# EasyEDA Pro project 无刷电机驱动板.epro, schematic 无刷电机&舵机驱动
Board Name: Board1; Create Date: 2024-11-26; Page Name: P1; Project Name: 无刷电机驱动板; Schematic Name: 无刷电机&舵机驱动; Update Date: 2024-12-31; Company: 海思路999号412所; Drawed: YienMaster; Page Size: A3; Version: V1.0
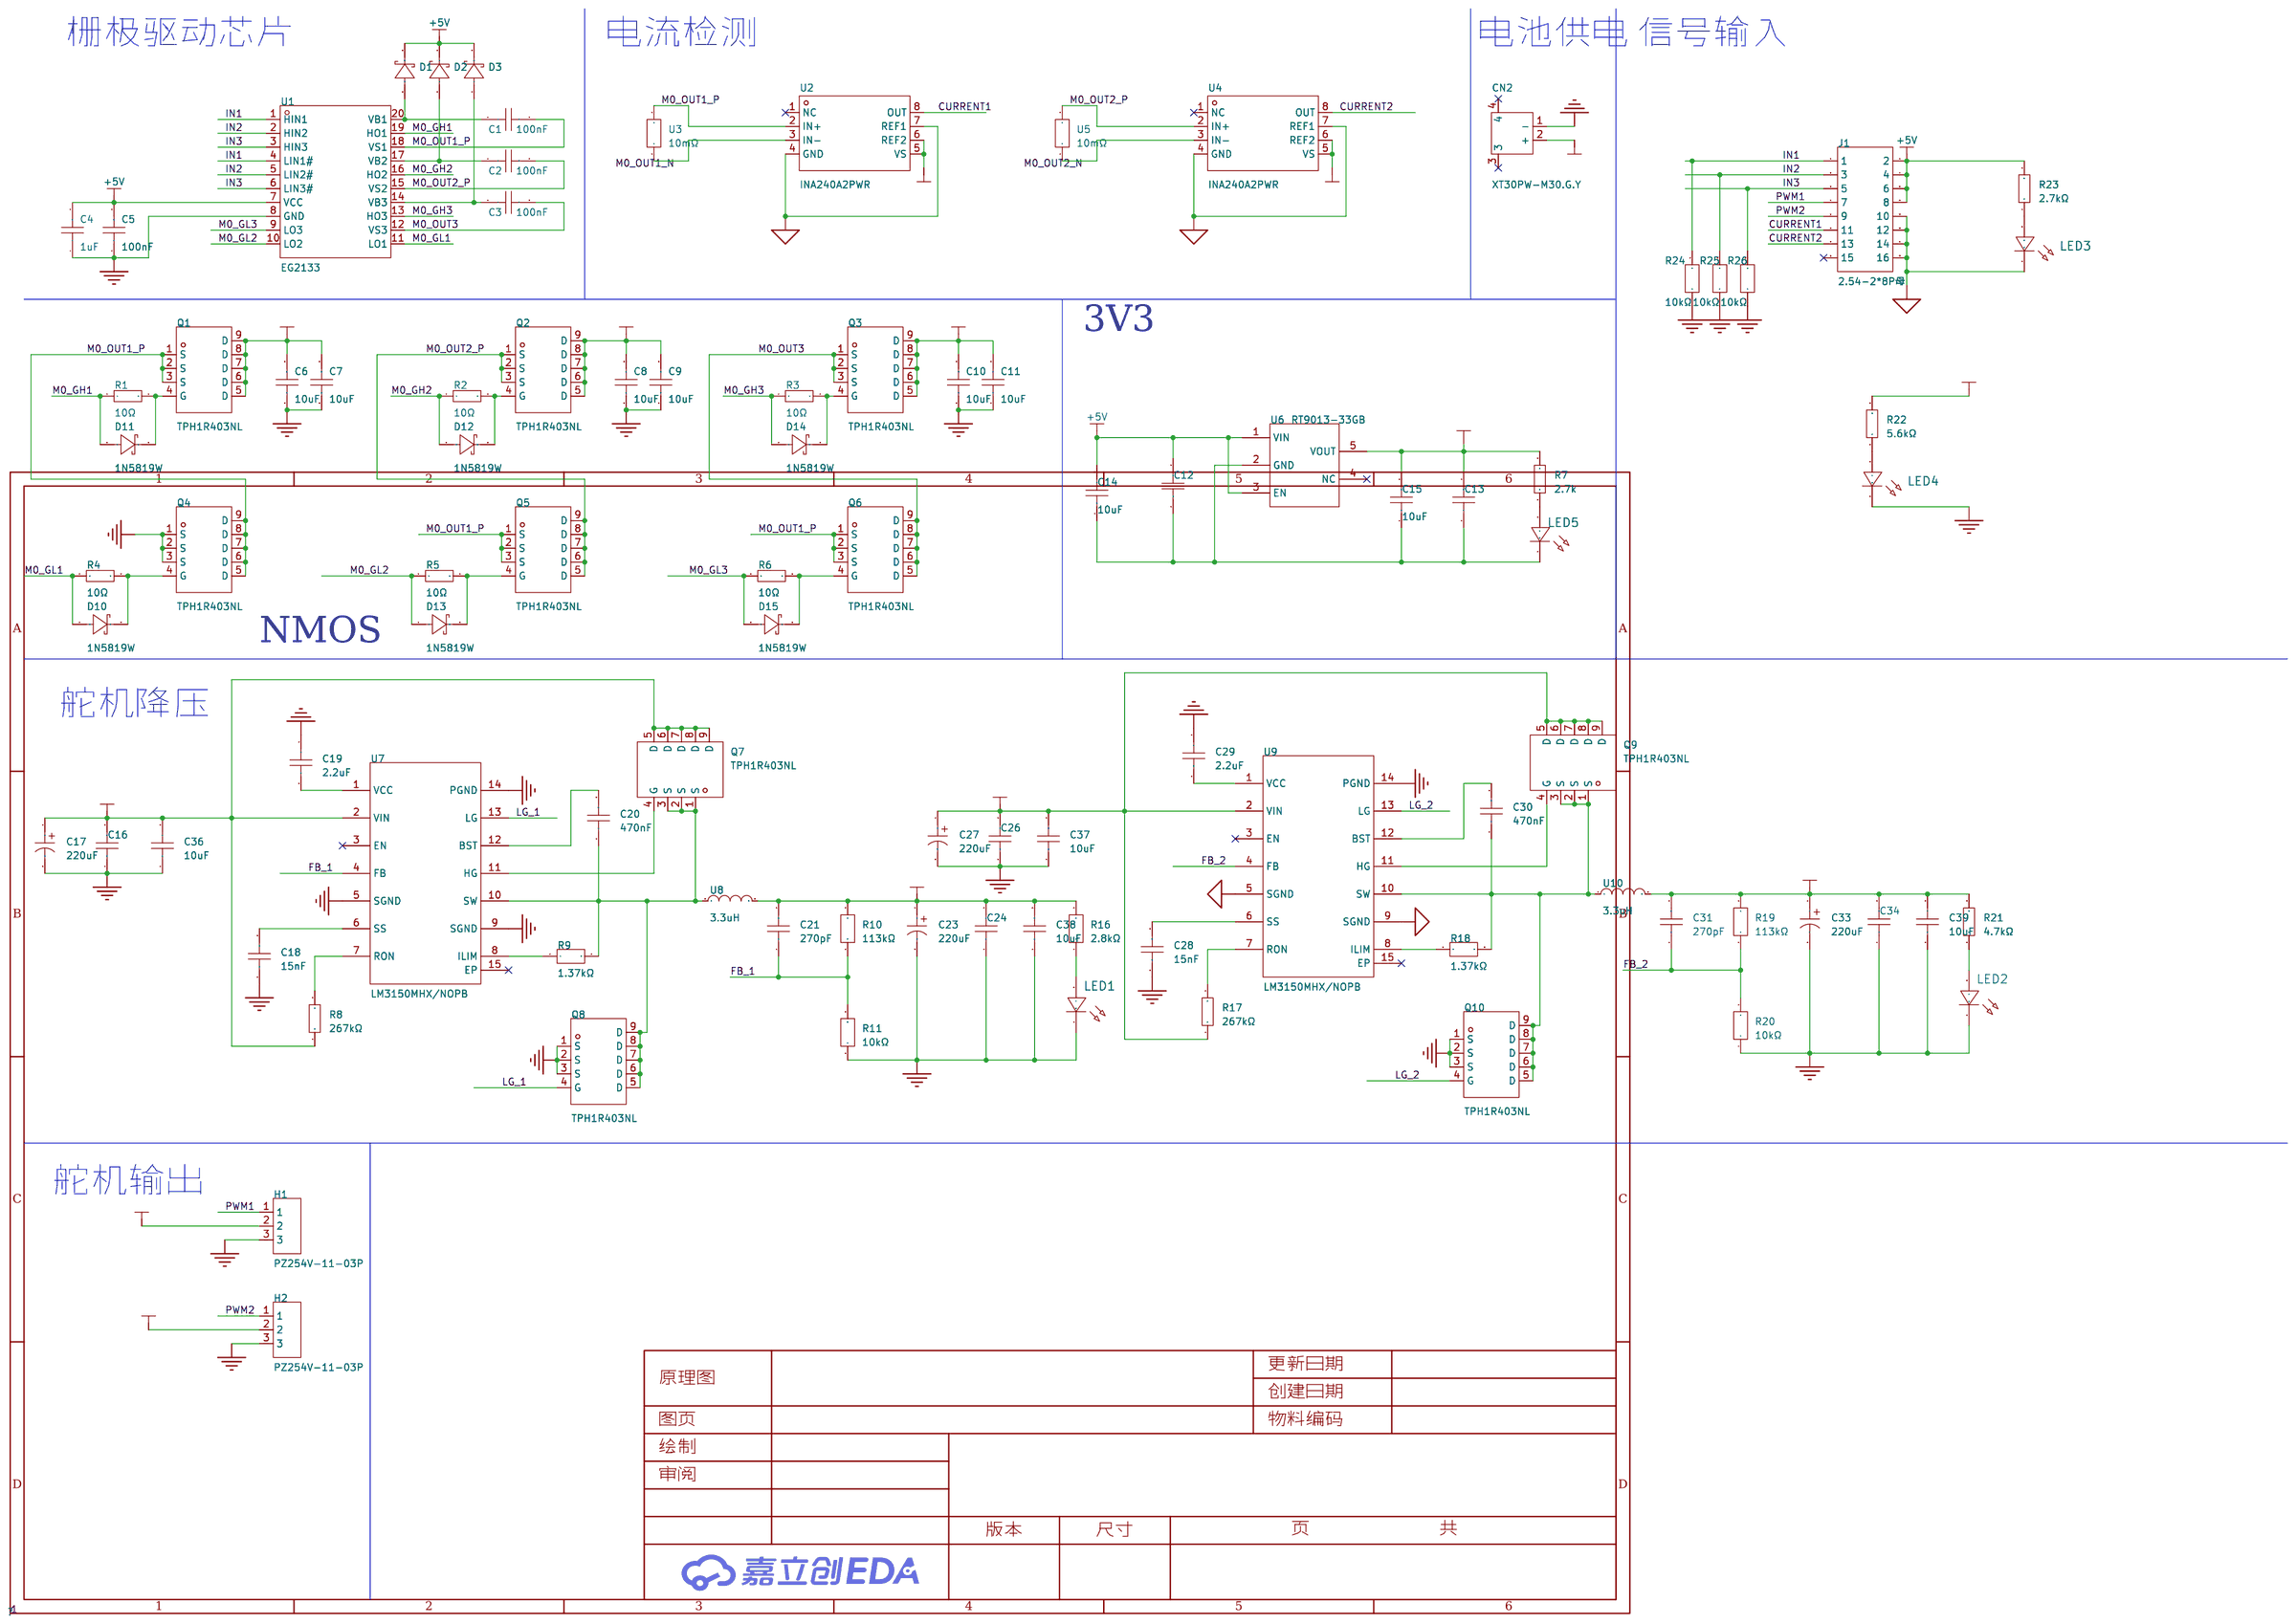
[diagram p0: schematic sheet]

## Parts
C1  100nF  [C0603]
C2  100nF  [C0603]
C3  100nF  [C0603]
C4  1uF  [C0603]
C5  100nF  [C0603]
C6  10uF  [C0603]
C7  10uF  [C0603]
C8  10uF  [C0603]
C9  10uF  [C0603]
C10  10uF  [C0603]
C11  10uF  [C0603]
C12  100nF  [C0603]
C13  100nF  [C0603]
C14  10uF  [C1206]
C15  10uF  [C1206]
C16  100nF  [C0603]
C17  220uF  [CAP-SMD_BD6.3-L6.6-W6.6-LS7.4-FD]
C18  15nF  [C0603]
C19  2.2uF  [C0805]
C20  470nF  [CAP-SMD_L1.6-W0.8-3]
C21  270pF  [C0603]
C23  220uF  [CAP-SMD_BD6.3-L6.6-W6.6-LS7.4-FD]
C24  100nF  [C0603]
C26  100nF  [C0603]
C27  220uF  [CAP-SMD_BD6.3-L6.6-W6.6-LS7.4-FD]
C28  15nF  [C0603]
C29  2.2uF  [C0805]
C30  470nF  [CAP-SMD_L1.6-W0.8-3]
C31  270pF  [C0603]
C33  220uF  [CAP-SMD_BD6.3-L6.6-W6.6-LS7.4-FD]
C34  100nF  [C0603]
C36  10uF  [C0805]
C37  10uF  [C0805]
C38  10uF  [C0805]
C39  10uF  [C0805]
CN2  XT30PW-M30.G.Y  [CONN-TH_XT30PW-M]
D1  1N5819W  [SOD-123_L2.7-W1.6-LS3.7-RD]
D2  1N5819W  [SOD-123_L2.7-W1.6-LS3.7-RD]
D3  1N5819W  [SOD-123_L2.7-W1.6-LS3.7-RD]
D10  1N5819W  [SOD-123_L2.7-W1.6-LS3.7-RD]
D11  1N5819W  [SOD-123_L2.7-W1.6-LS3.7-RD]
D12  1N5819W  [SOD-123_L2.7-W1.6-LS3.7-RD]
D13  1N5819W  [SOD-123_L2.7-W1.6-LS3.7-RD]
D14  1N5819W  [SOD-123_L2.7-W1.6-LS3.7-RD]
D15  1N5819W  [SOD-123_L2.7-W1.6-LS3.7-RD]
H1  PZ254V-11-03P  [HDR-TH_3P-P2.54-V-M]
H2  PZ254V-11-03P  [HDR-TH_3P-P2.54-V-M]
J1  2.54-2*8P母  [HDR-TH_16P-P2.54-V-F-R2-C8-S2.54]
LED1  -  [LED_0603]
LED2  -  [LED_0603]
LED3  -  [LED_0603]
LED4  -  [LED_0603]
LED5  -  [LED_0603]
Q1  TPH1R403NL  [DSOP-8_L5.0-W5.0-P1.27-LS6.0-BL-EP]
Q2  TPH1R403NL  [DSOP-8_L5.0-W5.0-P1.27-LS6.0-BL-EP]
Q3  TPH1R403NL  [DSOP-8_L5.0-W5.0-P1.27-LS6.0-BL-EP]
Q4  TPH1R403NL  [DSOP-8_L5.0-W5.0-P1.27-LS6.0-BL-EP]
Q5  TPH1R403NL  [DSOP-8_L5.0-W5.0-P1.27-LS6.0-BL-EP]
Q6  TPH1R403NL  [DSOP-8_L5.0-W5.0-P1.27-LS6.0-BL-EP]
Q7  TPH1R403NL  [DSOP-8_L5.0-W5.0-P1.27-LS6.0-BL-EP]
Q8  TPH1R403NL  [DSOP-8_L5.0-W5.0-P1.27-LS6.0-BL-EP]
Q9  TPH1R403NL  [DSOP-8_L5.0-W5.0-P1.27-LS6.0-BL-EP]
Q10  TPH1R403NL  [DSOP-8_L5.0-W5.0-P1.27-LS6.0-BL-EP]
R1  10Ω  [R0603]
R2  10Ω  [R0603]
R3  10Ω  [R0603]
R4  10Ω  [R0603]
R5  10Ω  [R0603]
R6  10Ω  [R0603]
R7  2.7k  [R0603]
R8  267kΩ  [R0603]
R9  1.37kΩ  [R0603]
R10  113kΩ  [R0603]
R11  10kΩ  [R0603]
R16  2.8kΩ  [R0603]
R17  267kΩ  [R0603]
R18  1.37kΩ  [R0603]
R19  113kΩ  [R0603]
R20  10kΩ  [R0603]
R21  4.7kΩ  [R0603]
R22  5.6kΩ  [R0603]
R23  2.7kΩ  [R0603]
R24  10kΩ  [R0603]
R25  10kΩ  [R0603]
R26  10kΩ  [R0603]
U1  EG2133  [TSSOP-20_L6.5-W4.4-P0.65-LS6.4-BL]
U2  INA240A2PWR  [TSSOP-8_L4.4-W3.0-P0.65-LS6.4-BL]
U3  10mΩ  [R1206]
U4  INA240A2PWR  [TSSOP-8_L4.4-W3.0-P0.65-LS6.4-BL]
U5  10mΩ  [R1206]
U6  RT9013-33GB  [SOT-23-5_L3.0-W1.7-P0.95-LS2.8-BL]
U7  LM3150MHX/NOPB  [HTSSOP-14_L5.0-W4.4-P0.65-LS6.4-BL-EP]
U8  3.3uH  [IND-SMD_L7.8-W7.6]
U9  LM3150MHX/NOPB  [HTSSOP-14_L5.0-W4.4-P0.65-LS6.4-BL-EP]
U10  3.3uH  [IND-SMD_L7.8-W7.6]

## Library data of the parts
C1-C3 C5 C12 C13 C16 C24 C26 C34 = CC0603KRX7R9BB104: 容值:100nF;精度:±10%;额定电压:50V;材质(温度系数):X7R;; LCSC Part Name: 100nF ±10% 50V; Supplier Part: C14663; Manufacturer: YAGEO(国巨); Supplier Footprint: 0603; JLCPCB Part Class: 基础库; Datasheet: https://atta.szlcsc.com/upload/public/pdf/source/20180910/C282072_33301C7F631E79921B82A8DAC6BCC5B3.pdf; Supplier: LCSC; Tolerance: ±10%; Voltage Rated: 50V; Temperature Coefficient: X7R
C4 = CGA0603X5R105K160JT: 容值:1uF;精度:±10%;额定电压:16V;材质(温度系数):X5R;; LCSC Part Name: 1uF ±10% 16V; Supplier Part: C6119849; Manufacturer: HRE(芯声); Supplier Footprint: 0603; JLCPCB Part Class: 扩展库; Supplier: LCSC; Tolerance: ±10%; Voltage Rated: 16V; Temperature Coefficient: X5R
C6-C11 = CGA0603X5R106K100JT: 容值:10uF;精度:±10%;额定电压:10V;材质(温度系数):X5R;; LCSC Part Name: 10uF ±10% 10V; Supplier Part: C6119842; Manufacturer: HRE(芯声); Supplier Footprint: 0603; JLCPCB Part Class: 扩展库; Supplier: LCSC; Tolerance: ±10%; Voltage Rated: 10V; Temperature Coefficient: X5R
C14 C15 = HGC1206R5106K500NSPJ: 容值:10uF;精度:±10%;额定电压:50V;材质(温度系数):X5R;; LCSC Part Name: 10uF ±10% 50V; Supplier Part: C7432781; Manufacturer: Chinocera(华瓷); Supplier Footprint: 1206; JLCPCB Part Class: 扩展库; Datasheet: https://atta.szlcsc.com/upload/public/pdf/source/20240320/FAC3FEC40A78BC5CCCE96C232A94D860.pdf; Supplier: LCSC; Tolerance: ±10%; Voltage Rated: 50V; Temperature Coefficient: X5R
C17 C23 C27 C33 = RVT1E221M0607: 容值:220uF;精度:±20%;额定电压:25V;纹波电流:150mA@120Hz;等效串联电阻:-;; LCSC Part Name: 220uF ±20% 25V; Supplier Part: C2918361; Manufacturer: ROQANG(容强); Supplier Footprint: SMD,D6.3xL7.7mm; JLCPCB Part Class: 扩展库; Datasheet: https://atta.szlcsc.com/upload/public/pdf/source/20211118/497C0614266278696CA52BDF245B991F.pdf; Supplier: LCSC; Tolerance: ±20%; Rated Voltage: 25V; Ripple Current: 150mA@120Hz; φD: 6.3mm; L: 7.7mm; Lifetime @ Temp: 2000hrs@105℃; Operating Temperature: -40℃~+105℃
C18 C28 = CC0603JRX7R9BB153: 容值:15nF;精度:±5%;额定电压:50V;材质(温度系数):X7R;; LCSC Part Name: 15nF ±5% 50V; Supplier Part: C519550; Manufacturer: YAGEO(国巨); Supplier Footprint: 0603; JLCPCB Part Class: 扩展库; Datasheet: https://atta.szlcsc.com/upload/public/pdf/source/20200423/C519550_A1941788CCD45C6ADF0AD0CE4A47CC49.pdf; Supplier: LCSC; Tolerance: ±5%; Voltage Rated: 50V; Temperature Coefficient: X7R
C19 C29 = CL21A225KBQNNNE: 容值:2.2uF;精度:±10%;额定电压:50V;材质(温度系数):X5R;; LCSC Part Name: 2.2uF ±10% 50V; Supplier Part: C377773; Manufacturer: SAMSUNG(三星); Supplier Footprint: 0805; JLCPCB Part Class: 基础库; Datasheet: https://atta.szlcsc.com/upload/public/pdf/source/20160218/1457707763339.pdf; Supplier: LCSC; Tolerance: ±10%; Voltage Rated: 50V; Temperature Coefficient: X5R
C20 C30 = CC0603KRX7R9BB474: 容值:470nF;精度:±10%;额定电压:50V;材质(温度系数):X7R;; LCSC Part Name: 470nF ±10% 50V; Supplier Part: C513577; Manufacturer: YAGEO(国巨); Supplier Footprint: 0603; JLCPCB Part Class: 扩展库; Datasheet: https://atta.szlcsc.com/upload/public/pdf/source/20200423/C519417_FF9998E3F66D767819CD86A66B468321.pdf; Supplier: LCSC; Tolerance: ±10%; Voltage Rated: 50V; Temperature Coefficient: X7R
C21 C31 = CL10C271JB8NNNC: 容值:270pF;精度:±5%;额定电压:50V;材质(温度系数):C0G;; LCSC Part Name: 270pF ±5% 50V; Supplier Part: C1657; Manufacturer: SAMSUNG(三星); Supplier Footprint: 0603; JLCPCB Part Class: 扩展库; Datasheet: https://atta.szlcsc.com/upload/public/pdf/source/20160218/1457707763339.pdf; Supplier: LCSC; Tolerance: ±5%; Voltage Rated: 50V; Temperature Coefficient: C0G
C36-C39 = GRM21BR61H106KE43L: 容值:10uF;精度:±10%;额定电压:50V;材质(温度系数):X5R;; LCSC Part Name: 10uF ±10% 50V; Supplier Part: C440198; Manufacturer: muRata(村田); Supplier Footprint: 0805; JLCPCB Part Class: 基础库; Datasheet: https://atta.szlcsc.com/upload/public/pdf/source/20230811/95AAE0C9AF55EDC31B7A4D8B733F534E.pdf; Supplier: LCSC; Tolerance: ±10%; Voltage Rated: 50V; Temperature Coefficient: X5R
CN2 = XT30PW-M30.G.Y: 类别:-;类型1:-;; LCSC Part Name: AMASS(艾迈斯)航模插头 卧式弯脚 XT30PW-M公头; Supplier Part: C431092; Manufacturer: AMASS(艾迈斯); JLCPCB Part Class: 扩展库; Datasheet: https://atta.szlcsc.com/upload/public/pdf/source/20220222/6A9F22F7850E25B33E1BE430ADF8560B.pdf; Supplier: LCSC; Type: 航模插头; RatedVoltage: DC 500V; InterfaceType: 公头; RatedCurrent: 15A; RecommendedWireGauge: 16/18/20AWG; contact resistance: 1.2mΩ; specifications: 2pin
D1-D3 D10-D15 = 1N5819W_C963381: 二极管配置:独立式;正向压降(Vf):600mV@200mA;直流反向耐压(Vr):40V;整流电流:350mA;; LCSC Part Name: 电压:40V 电流:350mA; Supplier Part: C963381; Manufacturer: JSMSEMI(杰盛微); Supplier Footprint: SOD-123; JLCPCB Part Class: Extended Part; Datasheet: https://atta.szlcsc.com/upload/public/pdf/source/20230807/ADD53622154D5B572F84A7B877E922CE.pdf; Supplier: LCSC; Diode Configuration: 独立式; Forward Voltage (Vf@If): 600mV@200mA; Reverse Voltage (Vr): 40V; Rectified Current: 350mA; Reverse Leakage Current (Ir): 5uA@30V
H1 H2 = PZ254V-11-03P: 插针结构:1x3P;间距:2.54mm;行距:-;圆针/方针:方针;安装类型:直插;排数:单排;总PIN位数:3P;额定电流:3A;额定电压:250V;配合针长度:6mm;塑高:2.5mm;端接针长度:3mm;工作温度范围:-40℃~+105℃;颜色:黑色;; LCSC Part Name: 间距:2.54mm 1x3P 直插 方针; Supplier Part: C2937625; Manufacturer: XFCN(兴飞); Supplier Footprint: 插件,P=2.54mm; JLCPCB Part Class: 扩展库; Datasheet: https://atta.szlcsc.com/upload/public/pdf/source/20200309/C492402_8335C3D49C4E4C618838D59BB1D024C1.pdf; Supplier: LCSC; Pin Structure: 1x3P; Pitch: 2.54mm; Circluar Pins/Square Pins: 方针; Mounting Type: 直插; Number of Rows: 单排; Number of Pins: 3P; Current Rating (Max): 3A; Voltage Rating (Max): 250V; Length of Mating Pin: 6mm; Insulation Height: 2.5mm; Length of End Connection Pin: 3mm; Operating Temperature Range: -40℃~+105℃; Color: 黑色
J1 = 2.54-2*8P母: 插孔结构:2x8P;间距:2.54mm;行距:2.54mm;安装类型:直插;排数:双排;总孔位数:16P;塑高:-;触头材质:黄铜;触头镀层:-;; LCSC Part Name: 间距:2.54mm 2x8P 直插; Supplier Part: C30734; Manufacturer: BOOMELE(博穆精密); Supplier Footprint: 插件,P=2.54mm; JLCPCB Part Class: 扩展库; Datasheet: https://atta.szlcsc.com/upload/public/pdf/source/20230817/400B44B2F3F98035DBB6B63900A9163B.pdf; Supplier: LCSC; Holes Structure: 2x8P; Pitch: 2.54mm; Row Spacing: 2.54mm; Mounting Type: 直插; Number of Rows: 双排; Number of Holes: 16P; Contact Material: 黄铜
LED1-LED5 = LED_0603-R: Supplier Footprint: 0603
Q1-Q10 = TPH1R403NL_C83440: 类型:1个N沟道;漏源电压(Vdss):30V;连续漏极电流(Id):150A;导通电阻(RDS(on)@Vgs,Id):1.7mΩ@4.5V,30A;功率:64W;阈值电压(Vgs(th)@Id):1.3V@0.5mA;; LCSC Part Name: 1个N沟道 耐压:30V 电流:150A; Supplier Part: C83440; Manufacturer: TOSHIBA(东芝); Supplier Footprint: DFN-8(5x6); JLCPCB Part Class: 扩展库; Datasheet: https://atta.szlcsc.com/upload/public/pdf/source/20170908/C83440_1504870121708958077.pdf; Supplier: LCSC; Type: 1个N沟道; Drain Source Voltage (Vdss): 30V; Continuous Drain Current (Id): 150A; Drain Source On Resistance (RDS(on)@Vgs,Id): 1.7mΩ@4.5V,30A; Power Dissipation (Pd): 64W; Gate Threshold Voltage (Vgs(th)@Id): 1.3V@0.5mA; Total Gate Charge (Qg@Vgs): 46nC@15V; Input Capacitance (Ciss@Vds): 3.4nF@15V; Reverse Transfer Capacitance (Crss@Vds): 200pF@15V; Operating Temperature: -55℃~+150℃
R1-R6 = 0603WAF100JT5E: 电阻类型:厚膜电阻;阻值:10Ω;精度:±1%;功率:100mW;最大工作电压:75V;温度系数:±400ppm/℃;; LCSC Part Name: 10Ω ±1% 100mW 厚膜电阻; Supplier Part: C22859; Manufacturer: UNI-ROYAL(厚声); Supplier Footprint: 0603; JLCPCB Part Class: 基础库; Datasheet: https://atta.szlcsc.com/upload/public/pdf/source/20200306/C422600_1E6D84923E4A46A82E41ADD87F860B5C.pdf; Supplier: LCSC; Type: 厚膜电阻; Tolerance: ±1%; Power(Watts): 100mW; Overload Voltage (Max): 75V; Temperature Coefficient: ±400ppm/℃; Operating Temperature Range: -55℃~+155℃
R7 = Res_0603: Supplier Footprint: 0603
R8 R17 = 0603WAF2673T5E: 电阻类型:厚膜电阻;阻值:267kΩ;精度:±1%;功率:100mW;最大工作电压:75V;温度系数:±100ppm/℃;; LCSC Part Name: 267kΩ ±1% 100mW 厚膜电阻; Supplier Part: C22963; Manufacturer: UNI-ROYAL(厚声); Supplier Footprint: 0603; JLCPCB Part Class: 扩展库; Datasheet: https://atta.szlcsc.com/upload/public/pdf/source/20200306/C422600_1E6D84923E4A46A82E41ADD87F860B5C.pdf; Supplier: LCSC; Type: 厚膜电阻; Tolerance: ±1%; Power(Watts): 100mW; Overload Voltage (Max): 75V; Temperature Coefficient: ±100ppm/℃; Operating Temperature Range: -55℃~+155℃
R9 R18 = RT0603CRE071K37L: 电阻类型:薄膜电阻;阻值:1.37kΩ;精度:±0.25%;功率:100mW;最大工作电压:75V;温度系数:±50ppm/℃;; LCSC Part Name: 薄膜电阻 1.37kΩ ±0.25% 100mW; Supplier Part: C705911; Manufacturer: YAGEO(国巨); Supplier Footprint: 0603; JLCPCB Part Class: 扩展库; Datasheet: https://atta.szlcsc.com/upload/public/pdf/source/20200720/C705911_C0C0480A0E18114730977775B5293834.pdf; Supplier: LCSC; Type: 薄膜电阻; Tolerance: ±0.25%; Power(Watts): 100mW; Overload Voltage (Max): 75V; Temperature Coefficient: ±50ppm/℃; Operating Temperature Range: -55℃~+155℃
R10 R19 = RT0603BRE07113KL: 电阻类型:薄膜电阻;阻值:113kΩ;精度:±0.1%;功率:100mW;温度系数:±50ppm/℃;; LCSC Part Name: 薄膜电阻 113kΩ ±0.1% 100mW; Supplier Part: C861633; Manufacturer: YAGEO(国巨); Supplier Footprint: 0603; JLCPCB Part Class: 扩展库; Datasheet: https://atta.szlcsc.com/upload/public/pdf/source/20200610/C326738_5639A9F1B6EB6E4AE2197577D3456E7F.pdf; Supplier: LCSC; Type: 薄膜电阻; Tolerance: ±0.1%; Power(Watts): 100mW; Temperature Coefficient: ±50ppm/℃; Operating Temperature Range: -55℃~+155℃
R11 R20 R24-R26 = FRC0603J103TS: 电阻类型:厚膜电阻;阻值:10kΩ;精度:±5%;功率:100mW;最大工作电压:75V;温度系数:±100ppm/℃;; LCSC Part Name: 10kΩ ±5% 100mW 厚膜电阻; Supplier Part: C2930027; Manufacturer: FOJAN(富捷); Supplier Footprint: 0603; JLCPCB Part Class: 扩展库; Datasheet: https://atta.szlcsc.com/upload/public/pdf/source/20211221/925EC7D7225764EE0046F22065062C87.pdf; Supplier: LCSC; Type: 厚膜电阻; Tolerance: ±5%; Power(Watts): 100mW; Overload Voltage (Max): 75V; Temperature Coefficient: ±100ppm/℃; Operating Temperature Range: -55℃~+155℃
R16 = FRC0603F2801TS: 电阻类型:厚膜电阻;阻值:2.8kΩ;精度:±1%;功率:100mW;最大工作电压:75V;温度系数:±100ppm/℃;; LCSC Part Name: 2.8kΩ ±1% 100mW 厚膜电阻; Supplier Part: C2933188; Manufacturer: FOJAN(富捷); Supplier Footprint: 0603; JLCPCB Part Class: 扩展库; Datasheet: https://atta.szlcsc.com/upload/public/pdf/source/20211221/925EC7D7225764EE0046F22065062C87.pdf; Supplier: LCSC; Type: 厚膜电阻; Tolerance: ±1%; Power(Watts): 100mW; Overload Voltage (Max): 75V; Temperature Coefficient: ±100ppm/℃; Operating Temperature Range: -55℃~+155℃
R21 = 0603WAF4701T5E: 电阻类型:厚膜电阻;阻值:4.7kΩ;精度:±1%;功率:100mW;最大工作电压:75V;温度系数:±100ppm/℃;; LCSC Part Name: 4.7kΩ ±1% 100mW 厚膜电阻; Supplier Part: C23162; Manufacturer: UNI-ROYAL(厚声); Supplier Footprint: 0603; JLCPCB Part Class: 基础库; Datasheet: https://atta.szlcsc.com/upload/public/pdf/source/20200306/C422600_1E6D84923E4A46A82E41ADD87F860B5C.pdf; Supplier: LCSC; Type: 厚膜电阻; Tolerance: ±1%; Power(Watts): 100mW; Overload Voltage (Max): 75V; Temperature Coefficient: ±100ppm/℃; Operating Temperature Range: -55℃~+155℃
R22 = 0603WAF5601T5E: 电阻类型:厚膜电阻;阻值:5.6kΩ;精度:±1%;功率:100mW;最大工作电压:75V;温度系数:±100ppm/℃;; LCSC Part Name: 5.6kΩ ±1% 100mW 厚膜电阻; Supplier Part: C23189; Manufacturer: UNI-ROYAL(厚声); Supplier Footprint: 0603; JLCPCB Part Class: 基础库; Datasheet: https://atta.szlcsc.com/upload/public/pdf/source/20200306/C422600_1E6D84923E4A46A82E41ADD87F860B5C.pdf; Supplier: LCSC; Type: 厚膜电阻; Tolerance: ±1%; Power(Watts): 100mW; Overload Voltage (Max): 75V; Temperature Coefficient: ±100ppm/℃; Operating Temperature Range: -55℃~+155℃
R23 = 0603WAF2701T5E: 电阻类型:厚膜电阻;阻值:2.7kΩ;精度:±1%;功率:100mW;最大工作电压:75V;温度系数:±100ppm/℃;; LCSC Part Name: 2.7kΩ ±1% 100mW 厚膜电阻; Supplier Part: C13167; Manufacturer: UNI-ROYAL(厚声); Supplier Footprint: 0603; JLCPCB Part Class: 基础库; Datasheet: https://atta.szlcsc.com/upload/public/pdf/source/20200306/C422600_1E6D84923E4A46A82E41ADD87F860B5C.pdf; Supplier: LCSC; Type: 厚膜电阻; Tolerance: ±1%; Power(Watts): 100mW; Overload Voltage (Max): 75V; Temperature Coefficient: ±100ppm/℃; Operating Temperature Range: -55℃~+155℃
U1 = EG2133_C190343: EG2133是一款高性价比的三相半桥驱动芯片，配合六颗Nmos可以组成三相直流无刷电机驱动器。; Supplier Part: C190343; Manufacturer: EG(屹晶微); Supplier Footprint: TSSOP-20; JLCPCB Part Class: 扩展库; Datasheet: https://atta.szlcsc.com/upload/public/pdf/source/20220627/F8A393EEBF3325F22DCB485BC683267F.pdf; Supplier: LCSC
U2 U4 = INA240A2PWR: 放大器数:单路;; Supplier Part: C129949; Manufacturer: TI(德州仪器); Supplier Footprint: TSSOP-8; JLCPCB Part Class: 扩展库; Datasheet: https://www.ti.com/cn/lit/gpn/ina240; Supplier: LCSC; Number of Channels: 单路; Supply Current: 1.8mA; Operating Temperature: -40℃~+125℃
U3 U5 = FRM121WFR010TM: 电阻类型:采样电阻;阻值:10mΩ;精度:±1%;额定压降:-;功率:1W;温度系数:±50ppm/℃;安装方式:-;; LCSC Part Name: 10mΩ ±1% 1W; Supplier Part: C7467248; Manufacturer: FOJAN(富捷); Supplier Footprint: 1206; JLCPCB Part Class: 扩展库; Datasheet: https://atta.szlcsc.com/upload/public/pdf/source/20240709/7FCE84187288C94C67B1004F90EDDF14.pdf; Supplier: LCSC; Type: 采样电阻; Tolerance: ±1%; Power(Watts): 1W; Temperature Coefficient: ±50ppm/℃
U6 = RT9013-33GB: 输出类型:固定;最大输入电压:5.5V;输出电压:3.3V;最大输出电流:500mA;电源纹波抑制比(PSRR):50dB@(10kHz);输出极性:正极;; LCSC Part Name: 输入5.5V 输出3.3V 500mA; Supplier Part: C47773; Manufacturer: RICHTEK(立锜); Supplier Footprint: SOT-23-5; JLCPCB Part Class: 扩展库; Datasheet: https://atta.szlcsc.com/upload/public/pdf/source/20150504/1457707282459.pdf; Supplier: LCSC; Output Type: 固定; Maximum Input Voltage: 5.5V; Output Voltage: 3.3V; MAX Output Current: 500mA; Power Supply Rejection Ratio (PSRR): 50dB@(10kHz); Dropout Voltage: 400mV@(500mA); standby current: 50uA; Operating Temperature: -40℃~+85℃; Output Polarity: 正极; Number of Outputs: 1
U7 U9 = LM3150MHX/NOPB: 功能类型:降压型;输出类型:可调;工作电压:6V~42V;输出电压:600mV~3.3V;输出电流:12A;; LCSC Part Name: LM3150 宽输入电压同步降压控制器; Supplier Part: C48112; Manufacturer: TI(德州仪器); Supplier Footprint: HTSSOP-14-EP; JLCPCB Part Class: 扩展库; Datasheet: https://www.ti.com/cn/lit/gpn/lm3150; Supplier: LCSC; Function: 降压型; Output Type: 可调; Input Voltage: 6V~42V; Output Voltage: 600mV~3.3V; Output Current: 12A; Switching Frequency: 500kHz; Operating Temperature: -40℃~+125℃; Synchronous Rectification: 是; Number of Outputs: 1; Topology: 降压式; Switch tube (built-in/external): 外置
U8 U10 = YSPIT0770A-3R3M: 电感值:3.3uH;精度:±20%;额定电流:15.1A;饱和电流(Isat):19.4A;类型:一体成型电感;; LCSC Part Name: 3.3uH ±20% 19.4A; Supplier Part: C19190806; Manufacturer: YJYCOIN(益嘉源); Supplier Footprint: SMD,7.6x7.8mm; Datasheet: https://atta.szlcsc.com/upload/public/pdf/source/20231103/4584E541A7477EF2C0EF6FA736417A6E.pdf; Supplier: LCSC; Tolerance: ±20%; Rated Current: 15.1A; Saturation Current (Isat): 19.4A; DC Resistance (DCR): 9.5mΩ; Type: 一体成型电感

## Nets
3V3: C13.2 C15.2 R7.2 U2.5(VS) U2.6(REF2) U4.5(VS) U4.6(REF2) U6.5(VOUT)
7.4V_1: C21.2 C23.1 C24.2 C38.2 H1.2 R10.2 R16.2 U8.2
7.4V_2: C31.2 C33.1 C34.2 C39.2 H2.2 R19.2 R21.2 U10.2
+5V: C4.2 C5.2 C12.2 C14.2 D1.2(C) D2.2(C) D3.2(C) J1.2 J1.4 J1.6 J1.8 R23.2 U1.7(VCC) U6.1(VIN) U6.3(EN)
AGND: J1.10 J1.12 J1.14 J1.16 LED3.1(C) U2.4(GND) U2.7(REF1) U4.4(GND) U4.7(REF1) U9.5(SGND) U9.9(SGND)
GND: C4.1 C5.1 C6.1 C7.1 C8.1 C9.1 C10.1 C11.1 C16.1 C17.2 C18.1 C19.1 C23.2 C24.1 C26.1 C27.2 C28.1 C29.1 C33.2 C34.1 C36.1 C37.1 C38.1 C39.1 CN2.1(-) H1.3 H2.3 LED1.1(C) LED2.1(C) LED4.1(C) Q4.1(S) Q4.2(S) Q4.3(S) Q8.1(S) Q8.2(S) Q8.3(S) Q10.1(S) Q10.2(S) Q10.3(S) R11.1 R20.1 R24.1 R25.1 R26.1 U1.8(GND) U7.5(SGND) U7.9(SGND) U7.14(PGND) U9.14(PGND)
VIN: C6.2 C7.2 C8.2 C9.2 C10.2 C11.2 C16.2 C17.1 C26.2 C27.1 C36.2 C37.2 CN2.2(+) Q1.5(D) Q1.6(D) Q1.7(D) Q1.8(D) Q1.9(D) Q2.5(D) Q2.6(D) Q2.7(D) Q2.8(D) Q2.9(D) Q3.5(D) Q3.6(D) Q3.7(D) Q3.8(D) Q3.9(D) Q7.5(D) Q7.6(D) Q7.7(D) Q7.8(D) Q7.9(D) Q9.5(D) Q9.6(D) Q9.7(D) Q9.8(D) Q9.9(D) R8.1 R17.1 R22.2 U7.2(VIN) U9.2(VIN)
CURRENT1: J1.11 U2.8(OUT)
CURRENT2: J1.13 U4.8(OUT)
FB_1: C21.1 R10.1 R11.2 U7.4(FB)
FB_2: C31.1 R19.1 R20.2 U9.4(FB)
IN1: J1.1 R24.2 U1.1(HIN1) U1.4(LIN1#)
IN2: J1.3 R25.2 U1.2(HIN2) U1.5(LIN2#)
IN3: J1.5 R26.2 U1.3(HIN3) U1.6(LIN3#)
LG_1: Q8.4(G) U7.13(LG)
LG_2: Q10.4(G) U9.13(LG)
M0_GH1: D11.1(A) R1.1 U1.19(HO1)
M0_GH2: D12.1(A) R2.1 U1.16(HO2)
M0_GH3: D14.1(A) R3.1 U1.13(HO3)
M0_GL1: D10.1(A) R4.1 U1.11(LO1)
M0_GL2: D13.1(A) R5.1 U1.10(LO2)
M0_GL3: D15.1(A) R6.1 U1.9(LO3)
M0_OUT1_N: U2.3(IN-) U3.1
M0_OUT1_P: C1.2 Q1.1(S) Q1.2(S) Q1.3(S) Q4.5(D) Q4.6(D) Q4.7(D) Q4.8(D) Q4.9(D) Q5.1(S) Q5.2(S) Q5.3(S) Q6.1(S) Q6.2(S) Q6.3(S) U1.18(VS1) U2.2(IN+) U3.2
M0_OUT2_N: U4.3(IN-) U5.1
M0_OUT2_P: C2.2 Q2.1(S) Q2.2(S) Q2.3(S) Q5.5(D) Q5.6(D) Q5.7(D) Q5.8(D) Q5.9(D) U1.15(VS2) U4.2(IN+) U5.2
M0_OUT3: C3.2 Q3.1(S) Q3.2(S) Q3.3(S) Q6.5(D) Q6.6(D) Q6.7(D) Q6.8(D) Q6.9(D) U1.12(VS3)
PWM1: H1.1 J1.7
PWM2: H2.1 J1.9
$1N5509: LED5.2(A) R7.1
$1N5510: C12.1 C13.1 C14.1 C15.1 LED5.1(C) U6.2(GND)
$1N6949: C18.2 U7.6(SS)
$1N7053: C19.2 U7.1(VCC)
$1N7065: R8.2 U7.7(RON)
$1N7282: Q7.4(G) U7.11(HG)
$1N7328: C20.2 U7.12(BST)
$1N7361: R9.1 U7.8(ILIM)
$1N9707: LED1.2(A) R16.1
$1N9909: C20.1 Q7.1(S) Q7.2(S) Q7.3(S) Q8.5(D) Q8.6(D) Q8.7(D) Q8.8(D) Q8.9(D) R9.2 U7.10(SW) U8.1
$1N10885: Q9.4(G) U9.11(HG)
$1N10896: C30.2 U9.12(BST)
$1N10900: C30.1 Q9.1(S) Q9.2(S) Q9.3(S) Q10.5(D) Q10.6(D) Q10.7(D) Q10.8(D) Q10.9(D) R18.2 U9.10(SW) U10.1
$1N10916: R18.1 U9.8(ILIM)
$1N10943: R17.2 U9.7(RON)
$1N10946: C28.2 U9.6(SS)
$1N10950: C29.2 U9.1(VCC)
$1N10954: LED2.2(A) R21.1
$1N12527: LED3.2(A) R23.1
$1N12568: LED4.2(A) R22.1
Net-(C1-1): C1.1 D1.1(A) U1.20(VB1)
Net-(C2-1): C2.1 D2.1(A) U1.17(VB2)
Net-(C3-1): C3.1 D3.1(A) U1.14(VB3)
Net-(D10-2): D10.2(C) Q4.4(G) R4.2
Net-(D11-2): D11.2(C) Q1.4(G) R1.2
Net-(D12-2): D12.2(C) Q2.4(G) R2.2
Net-(D13-2): D13.2(C) Q5.4(G) R5.2
Net-(D14-2): D14.2(C) Q3.4(G) R3.2
Net-(D15-2): D15.2(C) Q6.4(G) R6.2

Not connected (* = marked no-connect by the designer): CN2 3* 4*; J1 15*; U2 1(NC)*; U4 1(NC)*; U6 4(NC)*; U7 3(EN)* 15(EP)*; U9 3(EN)* 15(EP)*

## Notes on the sheet
- 栅极驱动芯片
- 电流检测
- 电池供电
- 信号输入
- 3V3
- NMOS
- 舵机降压
- 舵机输出
